# EAGLE schematic light_controller (EAGLE 8.5.0)
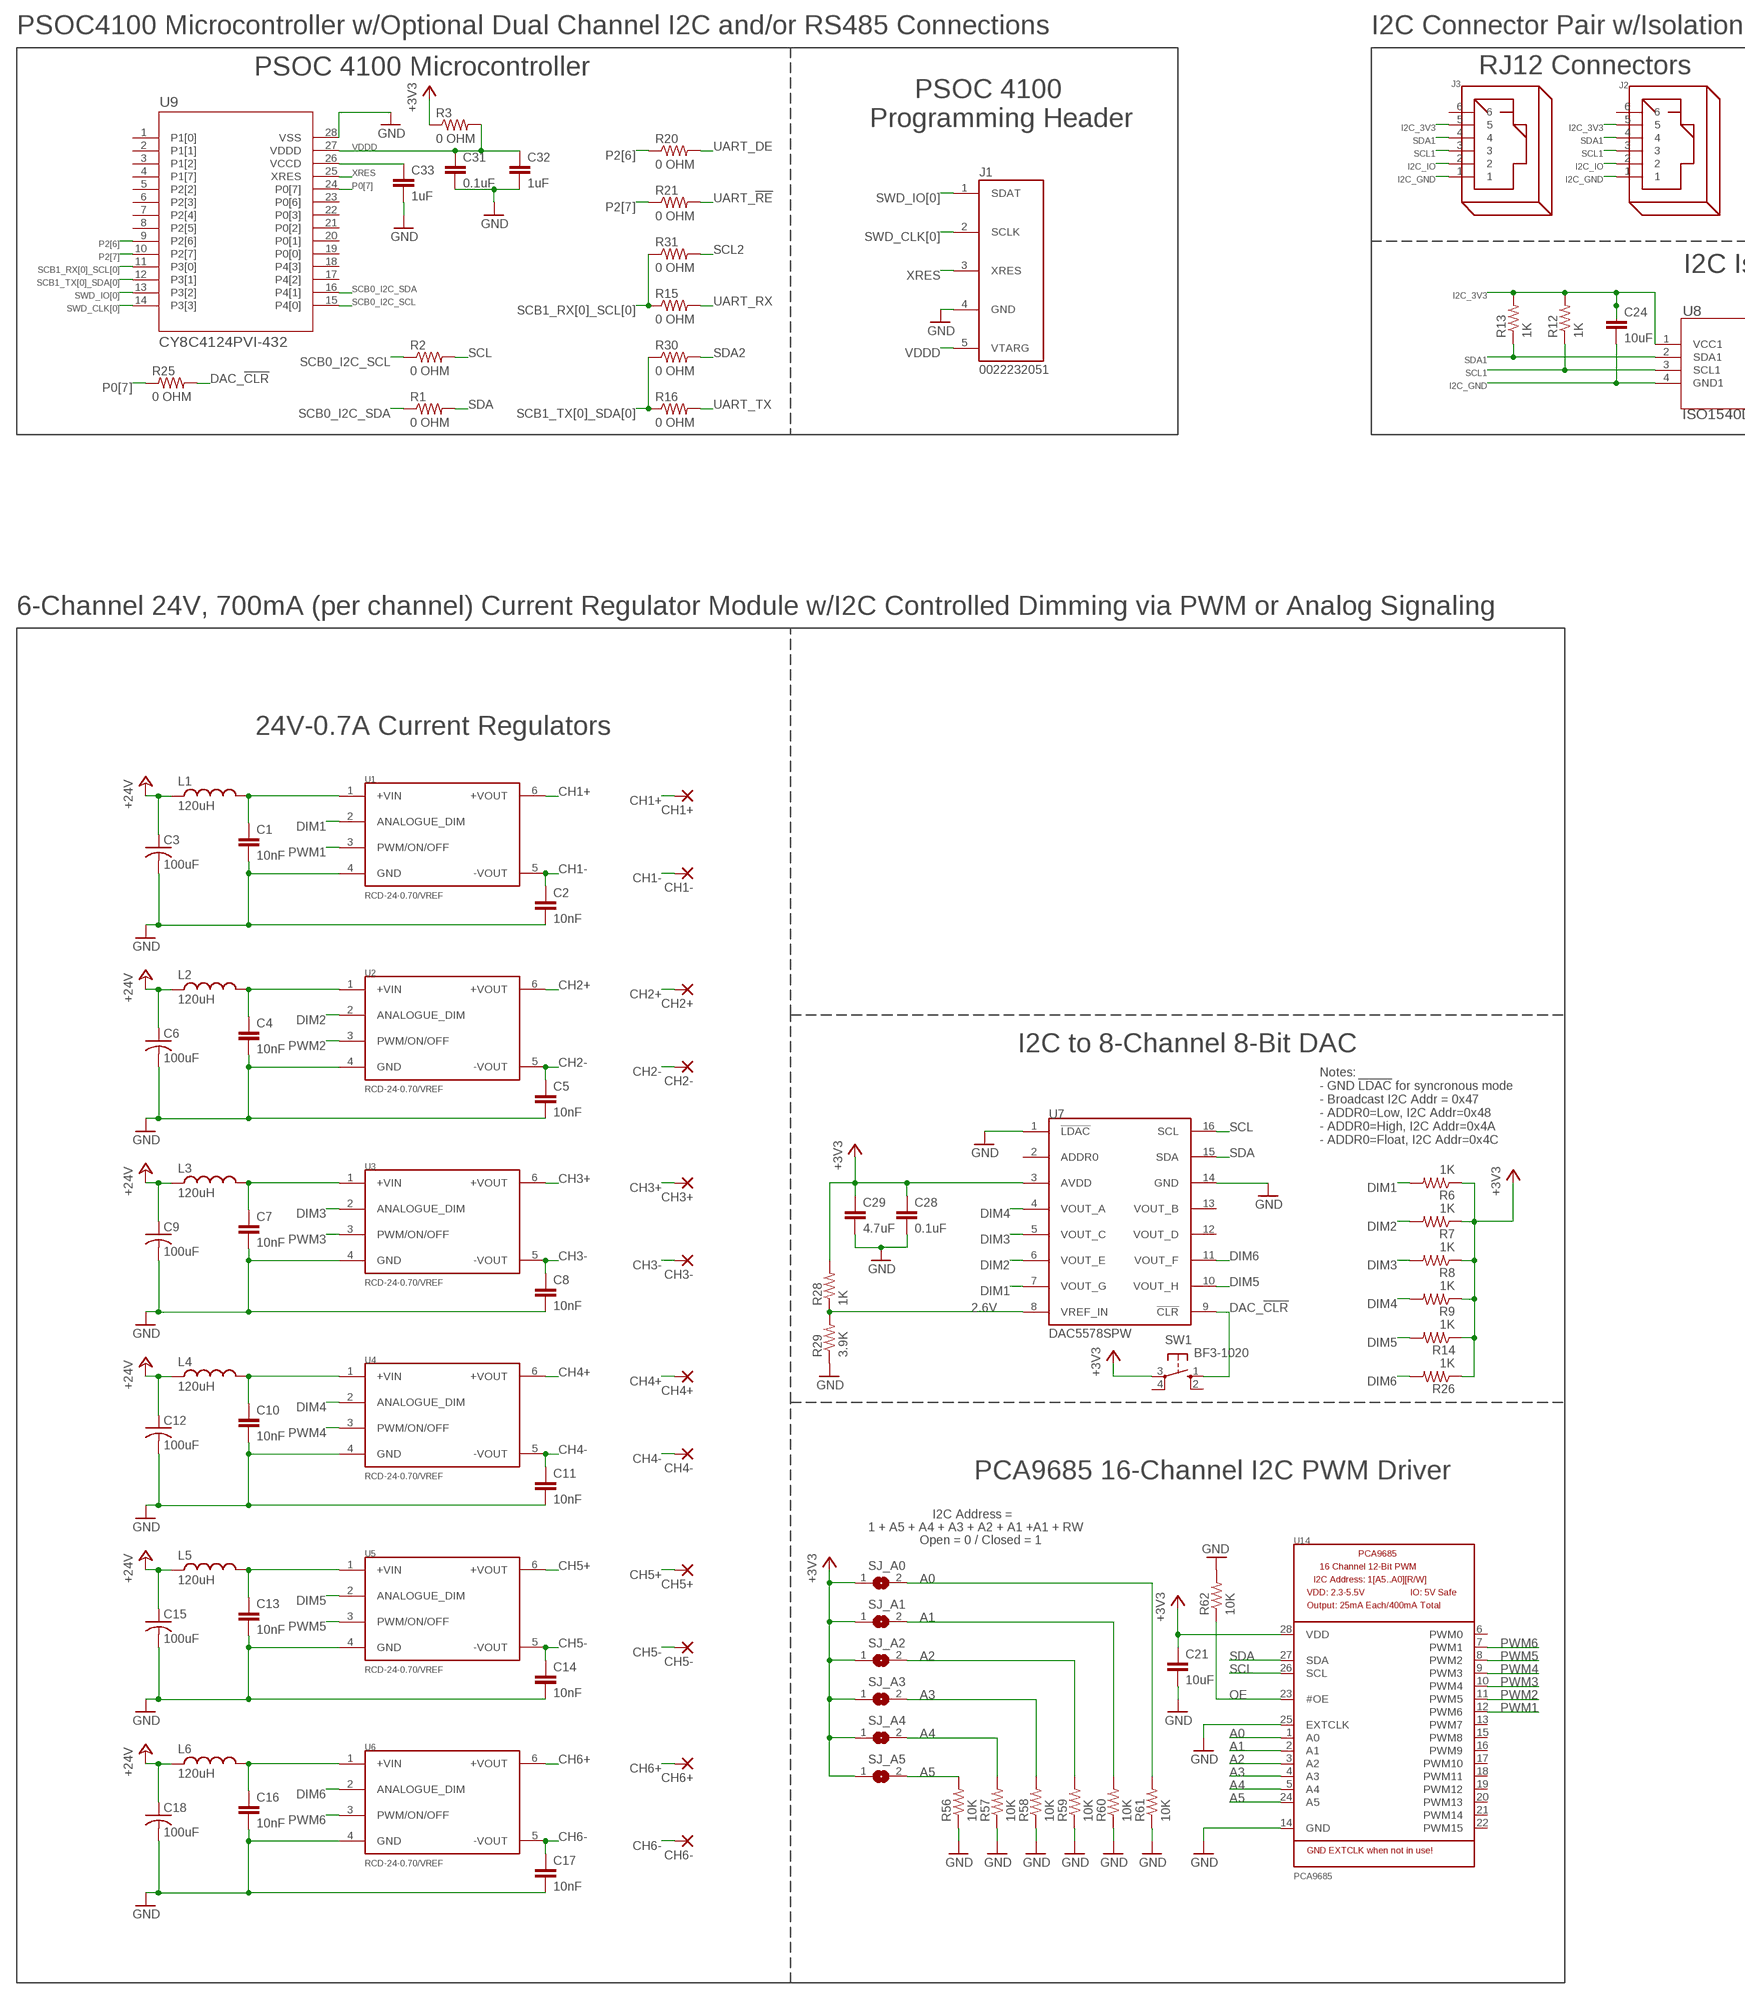
[diagram p0: schematic, sheet 1, part 1 of 2]
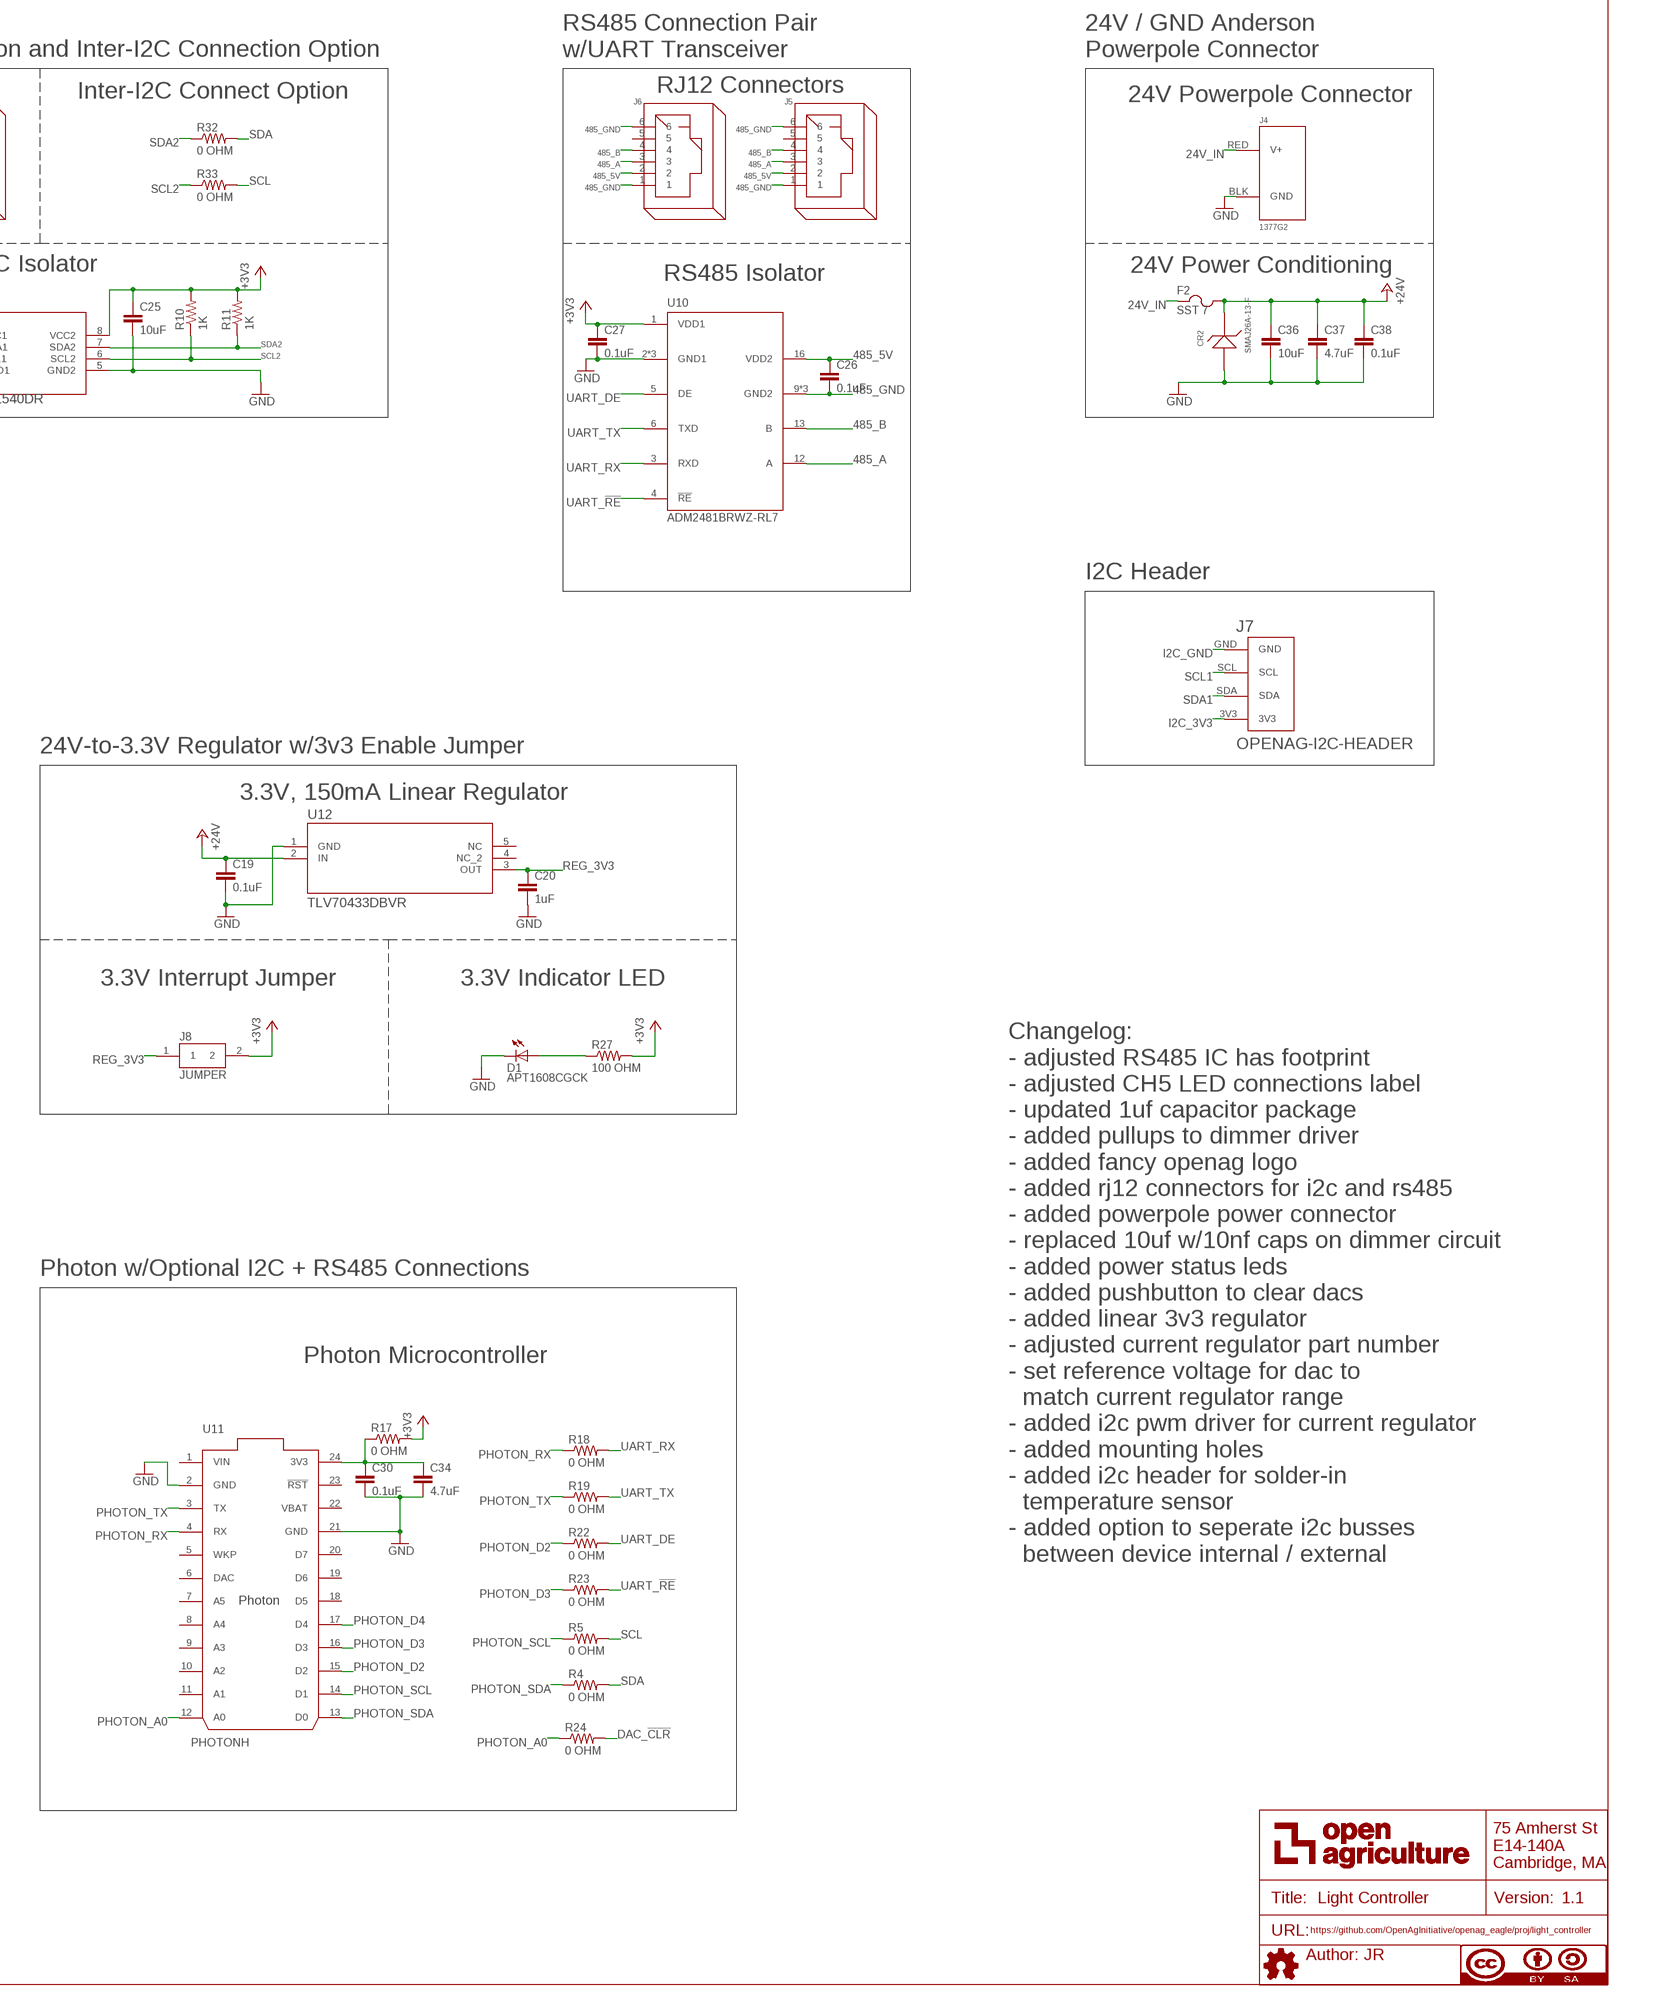
[diagram p1: schematic, sheet 1, part 2 of 2]

## Parts
C1  10nF  10NF-C0603C103K5RACTU  [C0603]
C2  10nF  10NF-C0603C103K5RACTU  [C0603]
C3  100uF  100UF-EEE-1HA101UP  [EEE-1HA101UP]
C4  10nF  10NF-C0603C103K5RACTU  [C0603]
C5  10nF  10NF-C0603C103K5RACTU  [C0603]
C6  100uF  100UF-EEE-1HA101UP  [EEE-1HA101UP]
C7  10nF  10NF-C0603C103K5RACTU  [C0603]
C8  10nF  10NF-C0603C103K5RACTU  [C0603]
C9  100uF  100UF-EEE-1HA101UP  [EEE-1HA101UP]
C10  10nF  10NF-C0603C103K5RACTU  [C0603]
C11  10nF  10NF-C0603C103K5RACTU  [C0603]
C12  100uF  100UF-EEE-1HA101UP  [EEE-1HA101UP]
C13  10nF  10NF-C0603C103K5RACTU  [C0603]
C14  10nF  10NF-C0603C103K5RACTU  [C0603]
C15  100uF  100UF-EEE-1HA101UP  [EEE-1HA101UP]
C16  10nF  10NF-C0603C103K5RACTU  [C0603]
C17  10nF  10NF-C0603C103K5RACTU  [C0603]
C18  100uF  100UF-EEE-1HA101UP  [EEE-1HA101UP]
C19  0.1uF  0.1UF-C0603C104K5RACTU  [C0603]
C20  1uF  1UF-CL10A105KB8NNNC  [C0603]
C21  10uF  10UF-GMK212BBJ106KG-T  [C0805]
C24  10uF  10UF-GMK212BBJ106KG-T  [C0805]
C25  10uF  10UF-GMK212BBJ106KG-T  [C0805]
C26  0.1uF  0.1UF-C0603C104K5RACTU  [C0603]
C27  0.1uF  0.1UF-C0603C104K5RACTU  [C0603]
C28  0.1uF  0.1UF-C0603C104K5RACTU  [C0603]
C29  4.7uF  4.7UF-CL21A475KBQNNNE  [C0805]
C30  0.1uF  0.1UF-C0603C104K5RACTU  [C0603]
C31  0.1uF  0.1UF-C0603C104K5RACTU  [C0603]
C32  1uF  1UF-CL10A105KB8NNNC  [C0603]
C33  1uF  1UF-CL10A105KB8NNNC  [C0603]
C34  4.7uF  4.7UF-CL21A475KBQNNNE  [C0805]
C36  10uF  10UF-GMK212BBJ106KG-T  [C0805]
C37  4.7uF  4.7UF-CL21A475KBQNNNE  [C0805]
C38  0.1uF  0.1UF-C0603C104K5RACTU  [C0603]
CH1+  3,17/1,3  [3,17/1,3]
CH1-  3,17/1,3  [3,17/1,3]
CH2+  3,17/1,3  [3,17/1,3]
CH2-  3,17/1,3  [3,17/1,3]
CH3+  3,17/1,3  [3,17/1,3]
CH3-  3,17/1,3  [3,17/1,3]
CH4+  3,17/1,3  [3,17/1,3]
CH4-  3,17/1,3  [3,17/1,3]
CH5+  3,17/1,3  [3,17/1,3]
CH5-  3,17/1,3  [3,17/1,3]
CH6+  3,17/1,3  [3,17/1,3]
CH6-  3,17/1,3  [3,17/1,3]
CR2  SMAJ26A-13-F  [SMA]
D1  APT1608CGCK  [CHIPLED_0603]
F2  SST 7  SST_7  [SS]
FRAME1  DOCFIELD  [DOCFIELD]
J1  0022232051  MINI-PROG3-5POS-MATING-CONNECTOR  [22-23-2051]
J2  OPENAG-I2C-RJ12  [OPENAG-I2C-RJ12]
J3  OPENAG-I2C-RJ12  [OPENAG-I2C-RJ12]
J4  1377G2  1377G21377G2  [1377G2]
J5  OPENAG-RS485-RJ12  [OPENAG-RS485-RJ12]
J6  OPENAG-RS485-RJ12  [OPENAG-RS485-RJ12]
J7  OPENAG-I2C-HEADER  [OPENAG-I2C-HEADER]
J8  JUMPER  100-MIL-HEADER-JUMPER  [1X2-100-MIL-HEADER]
L1  120uH  120UH-74404064121  [74404064121]
L2  120uH  120UH-74404064121  [74404064121]
L3  120uH  120UH-74404064121  [74404064121]
L4  120uH  120UH-74404064121  [74404064121]
L5  120uH  120UH-74404064121  [74404064121]
L6  120uH  120UH-74404064121  [74404064121]
R1  0 OHM  0OHM-RC0603JR-070RL  [RC0603N]
R2  0 OHM  0OHM-RC0603JR-070RL  [RC0603N]
R3  0 OHM  0OHM-RC0603JR-070RL  [RC0603N]
R4  0 OHM  0OHM-RC0603JR-070RL  [RC0603N]
R5  0 OHM  0OHM-RC0603JR-070RL  [RC0603N]
R6  1K  1K-ERJ-PB3D1001V  [RC0603N]
R7  1K  1K-ERJ-PB3D1001V  [RC0603N]
R8  1K  1K-ERJ-PB3D1001V  [RC0603N]
R9  1K  1K-ERJ-PB3D1001V  [RC0603N]
R10  1K  1K-ERJ-PB3D1001V  [RC0603N]
R11  1K  1K-ERJ-PB3D1001V  [RC0603N]
R12  1K  1K-ERJ-PB3D1001V  [RC0603N]
R13  1K  1K-ERJ-PB3D1001V  [RC0603N]
R14  1K  1K-ERJ-PB3D1001V  [RC0603N]
R15  0 OHM  0OHM-RC0603JR-070RL  [RC0603N]
R16  0 OHM  0OHM-RC0603JR-070RL  [RC0603N]
R17  0 OHM  0OHM-RC0603JR-070RL  [RC0603N]
R18  0 OHM  0OHM-RC0603JR-070RL  [RC0603N]
R19  0 OHM  0OHM-RC0603JR-070RL  [RC0603N]
R20  0 OHM  0OHM-RC0603JR-070RL  [RC0603N]
R21  0 OHM  0OHM-RC0603JR-070RL  [RC0603N]
R22  0 OHM  0OHM-RC0603JR-070RL  [RC0603N]
R23  0 OHM  0OHM-RC0603JR-070RL  [RC0603N]
R24  0 OHM  0OHM-RC0603JR-070RL  [RC0603N]
R25  0 OHM  0OHM-RC0603JR-070RL  [RC0603N]
R26  1K  1K-ERJ-PB3D1001V  [RC0603N]
R27  100 OHM  100OHM-RC0603JR-07100RL  [RC0603N]
R28  1K  1K-ERJ-PB3D1001V  [RC0603N]
R29  3.9K  3.9K-RC0603JR-073K9L  [RC0603N]
R30  0 OHM  0OHM-RC0603JR-070RL  [RC0603N]
R31  0 OHM  0OHM-RC0603JR-070RL  [RC0603N]
R32  0 OHM  0OHM-RC0603JR-070RL  [RC0603N]
R33  0 OHM  0OHM-RC0603JR-070RL  [RC0603N]
R56  10K  10K-ERJ-3EKF1002V  [RC0603N]
R57  10K  10K-ERJ-3EKF1002V  [RC0603N]
R58  10K  10K-ERJ-3EKF1002V  [RC0603N]
R59  10K  10K-ERJ-3EKF1002V  [RC0603N]
R60  10K  10K-ERJ-3EKF1002V  [RC0603N]
R61  10K  10K-ERJ-3EKF1002V  [RC0603N]
R62  10K  10K-ERJ-3EKF1002V  [RC0603N]
SJ_A0  SOLDERJUMPERREFLOW_NOPASTE  [SOLDERJUMPER_REFLOW_NOPASTE]
SJ_A1  SOLDERJUMPERREFLOW_NOPASTE  [SOLDERJUMPER_REFLOW_NOPASTE]
SJ_A2  SOLDERJUMPERREFLOW_NOPASTE  [SOLDERJUMPER_REFLOW_NOPASTE]
SJ_A3  SOLDERJUMPERREFLOW_NOPASTE  [SOLDERJUMPER_REFLOW_NOPASTE]
SJ_A4  SOLDERJUMPERREFLOW_NOPASTE  [SOLDERJUMPER_REFLOW_NOPASTE]
SJ_A5  SOLDERJUMPERREFLOW_NOPASTE  [SOLDERJUMPER_REFLOW_NOPASTE]
SW1  BF3-1020  [B3F-10XX]
U1  RCD-24-0.70/VREF  [RCD-24-PINNED]
U2  RCD-24-0.70/VREF  [RCD-24-PINNED]
U3  RCD-24-0.70/VREF  [RCD-24-PINNED]
U4  RCD-24-0.70/VREF  [RCD-24-PINNED]
U5  RCD-24-0.70/VREF  [RCD-24-PINNED]
U6  RCD-24-0.70/VREF  [RCD-24-PINNED]
U7  DAC5578SPW  [TSSOP16]
U8  ISO1540DR  [D8]
U9  CY8C4124PVI-432  [SSOP-28]
U10  ADM2481BRWZ-RL7  [SOIC16LWB]
U11  PHOTONH  PHOTONHPHOTONH  [PHOTON]
U12  TLV70433DBVR  TLV70433DBVRDBV5-M  [DBV5-M]
U14  PCA9685  PCA9685PW/Q900,118  [TSSOP28]

## Nets
2.6V: R28.1 R29.2 U7.8(VREF_IN)
24V_IN: F2.1 J4.RED(V+)
485_5V: C26.1 J5.2 J6.2 U10.16(VDD2)
485_A: J5.3 J6.3 U10.12(A)
485_B: J5.4 J6.4 U10.13(B)
485_GND: C26.2 J5.1 J5.6 J6.1 J6.6 U10.9(GND2) U10.10(GND2) U10.15(GND2)
+3V3: C21.1 C25.1 C27.1 C28.1 C29.1 J8.2 R3.1 R6.1 R7.1 R8.1 R9.1 R10.2 R11.2 R14.1 R17.2 R26.1 R27.2 R28.2 SJ_A0.1 SJ_A1.1 SJ_A2.1 SJ_A3.1 SJ_A4.1 SJ_A5.1 SW1.3(P) U7.3(AVDD) U8.8(VCC2) U10.1(VDD1) U14.28(VDD)
+24V: C3.+(1(+)) C6.+(1(+)) C9.+(1(+)) C12.+(1(+)) C15.+(1(+)) C18.+(1(+)) C19.1 C36.1 C37.1 C38.1 CR2.1 F2.2 L1.1 L2.1 L3.1 L4.1 L5.1 L6.1 U12.2(IN)
A0: R61.2 SJ_A0.2 U14.1(A0)
A1: R60.2 SJ_A1.2 U14.2(A1)
A2: R59.2 SJ_A2.2 U14.3(A2)
A3: R58.2 SJ_A3.2 U14.4(A3)
A4: R57.2 SJ_A4.2 U14.5(A4)
A5: R56.2 SJ_A5.2 U14.24(A5)
CH1+: CH1+.1(P) U1.6(+VOUT)
CH1-: C2.1 CH1-.1(P) U1.5(-VOUT)
CH2+: CH2+.1(P) U2.6(+VOUT)
CH2-: C5.1 CH2-.1(P) U2.5(-VOUT)
CH3+: CH3+.1(P) U3.6(+VOUT)
CH3-: C8.1 CH3-.1(P) U3.5(-VOUT)
CH4+: CH4+.1(P) U4.6(+VOUT)
CH4-: C11.1 CH4-.1(P) U4.5(-VOUT)
CH5+: CH5+.1(P) U5.6(+VOUT)
CH5-: C14.1 CH5-.1(P) U5.5(-VOUT)
CH6+: CH6+.1(P) U6.6(+VOUT)
CH6-: C17.1 CH6-.1(P) U6.5(-VOUT)
DAC_!CLR!: R24.2 R25.2 SW1.1(S) U7.9(!CLR!)
DIM1: R6.2 U1.2(ANALOGUE_DIM) U7.7(VOUT_G)
DIM2: R7.2 U2.2(ANALOGUE_DIM) U7.6(VOUT_E)
DIM3: R8.2 U3.2(ANALOGUE_DIM) U7.5(VOUT_C)
DIM4: R9.2 U4.2(ANALOGUE_DIM) U7.4(VOUT_A)
DIM5: R14.2 U5.2(ANALOGUE_DIM) U7.10(VOUT_H)
DIM6: R26.2 U6.2(ANALOGUE_DIM) U7.11(VOUT_F)
GND: C1.2 C2.2 C3.-(2(-)) C4.2 C5.2 C6.-(2(-)) C7.2 C8.2 C9.-(2(-)) C10.2 C11.2 C12.-(2(-)) C13.2 C14.2 C15.-(2(-)) C16.2 C17.2 C18.-(2(-)) C19.2 C20.2 C21.2 C25.2 C27.2 C28.2 C29.2 C30.2 C31.2 C32.2 C33.2 C34.2 C36.2 C37.2 C38.2 CR2.2 D1.C J1.4(GND) J4.BLK(GND) R29.1 R56.1 R57.1 R58.1 R59.1 R60.1 R61.1 R62.2 U1.4(GND) U2.4(GND) U3.4(GND) U4.4(GND) U5.4(GND) U6.4(GND) U7.1(!LDAC!) U7.14(GND) U8.5(GND2) U9.28(VSS) U10.2(GND1) U10.7(GND1) U10.8(GND1) U11.2(GND) U11.21(GND) U12.1(GND) U14.14(GND) U14.25(EXTCLK)
I2C_3V3: C24.1 J2.5 J3.5 J7.3V3 R12.2 R13.2 U8.1(VCC1)
I2C_GND: C24.2 J2.1 J3.1 J7.GND U8.4(GND1)
I2C_IO: J2.2 J3.2
N$1: C1.1 L1.2 U1.1(+VIN)
N$2: C4.1 L2.2 U2.1(+VIN)
N$3: D1.A R27.1
N$4: C7.1 L3.2 U3.1(+VIN)
N$5: C10.1 L4.2 U4.1(+VIN)
N$6: C13.1 L5.2 U5.1(+VIN)
N$7: C16.1 L6.2 U6.1(+VIN)
N$8: C30.1 C34.1 R17.1 U11.24(3V3)
N$23: C33.1 U9.26(VCCD)
OE: R62.1 U14.23(#OE)
P0[7]: R25.1 U9.24(P0[7])
P2[6]: R20.1 U9.9(P2[6])
P2[7]: R21.1 U9.10(P2[7])
PHOTON_A0: R24.1 U11.12(A0)
PHOTON_D2: R22.1 U11.15(D2)
PHOTON_D3: R23.1 U11.16(D3)
PHOTON_D4: U11.17(D4)
PHOTON_RX: R18.1 U11.4(RX)
PHOTON_SCL: R5.1 U11.14(D1)
PHOTON_SDA: R4.1 U11.13(D0)
PHOTON_TX: R19.1 U11.3(TX)
PWM1: U1.3(PWM/ON/OFF) U14.12(PWM6)
PWM2: U2.3(PWM/ON/OFF) U14.11(PWM5)
PWM3: U3.3(PWM/ON/OFF) U14.10(PWM4)
PWM4: U4.3(PWM/ON/OFF) U14.9(PWM3)
PWM5: U5.3(PWM/ON/OFF) U14.8(PWM2)
PWM6: U6.3(PWM/ON/OFF) U14.7(PWM1)
REG_3V3: C20.1 J8.1 U12.3(OUT)
SCB0_I2C_SCL: R2.1 U9.15(P4[0])
SCB0_I2C_SDA: R1.1 U9.16(P4[1])
SCB1_RX[0]_SCL[0]: R15.1 R31.1 U9.11(P3[0])
SCB1_TX[0]_SDA[0]: R16.1 R30.1 U9.12(P3[1])
SCL: R2.2 R5.2 R33.2 U7.16(SCL) U14.26(SCL)
SCL1: J2.3 J3.3 J7.SCL R12.1 U8.3(SCL1)
SCL2: R10.1 R31.2 R33.1 U8.6(SCL2)
SDA: R1.2 R4.2 R32.2 U7.15(SDA) U14.27(SDA)
SDA1: J2.4 J3.4 J7.SDA R13.1 U8.2(SDA1)
SDA2: R11.1 R30.2 R32.1 U8.7(SDA2)
SWD_CLK[0]: J1.2(SCLK) U9.14(P3[3])
SWD_IO[0]: J1.1(SDAT) U9.13(P3[2])
UART_!RE!: R21.2 R23.2 U10.4(!RE!)
UART_DE: R20.2 R22.2 U10.5(DE)
UART_RX: R15.2 R18.2 U10.3(RXD)
UART_TX: R16.2 R19.2 U10.6(TXD)
VDDD: C31.1 C32.1 J1.5(VTARG) R3.2 U9.27(VDDD)
XRES: J1.3(XRES) U9.25(XRES)
Unconnected: J2.6 J3.6 J5.5 J6.5 SW1.2(S1) SW1.4(P1) U7.2(ADDR0) U7.12(VOUT_D) U7.13(VOUT_B) U9.1(P1[0]) U9.2(P1[1]) U9.3(P1[2]) U9.4(P1[7]) U9.5(P2[2]) U9.6(P2[3]) U9.7(P2[4]) U9.8(P2[5]) U9.17(P4[2]) U9.18(P4[3]) U9.19(P0[0]) U9.20(P0[1]) U9.21(P0[2]) U9.22(P0[3]) U9.23(P0[6]) U11.5(WKP) U11.6(DAC) U11.7(A5) U11.8(A4) U11.9(A3) U11.10(A2) U11.11(A1) U11.18(D5) U11.19(D6) U11.20(D7) U11.23(!RST) U12.4(NC_2) U12.5(NC) U14.6(PWM0) U14.13(PWM7) U14.15(PWM8) U14.16(PWM9) U14.17(PWM10) U14.18(PWM11) U14.19(PWM12) U14.20(PWM13) U14.21(PWM14) U14.22(PWM15)

## Notes on the sheet
- PSOC4100 Microcontroller w/Optional Dual Channel I2C and/or RS485 Connections | I2C Connector Pair w/Isolation and Inter-I2C Connection Option
- RS485 Connection Pair 
  w/UART Transceiver
- 24V / GND Anderson
  Powerpole Connector
- PSOC 4100 Microcontroller | RJ12 Connectors | Inter-I2C Connect Option | RJ12 Connectors
- 24V Powerpole Connector
- PSOC 4100 
  Programming Header
- I2C Isolator | 24V Power Conditioning
- RS485 Isolator
- 6-Channel 24V, 700mA (per channel) Current Regulator Module w/I2C Controlled Dimming via PWM or Analog Signaling | I2C Header
- 24V-0.7A Current Regulators
- 24V-to-3.3V Regulator w/3v3 Enable Jumper
- 3.3V, 150mA Linear Regulator
- I2C to 8-Channel 8-Bit DAC
- 3.3V Interrupt Jumper | 3.3V Indicator LED
- Notes:
  - GND !LDAC! for syncronous mode
  - Broadcast I2C Addr = 0x47
  - ADDR0=Low, I2C Addr=0x48
  - ADDR0=High, I2C Addr=0x4A
  - ADDR0=Float, I2C Addr=0x4C
- Photon w/Optional I2C + RS485 Connections
- PCA9685 16-Channel I2C PWM Driver | Photon Microcontroller
- I2C Address =
- 1 + A5 + A4 + A3 + A2 + A1 +A1 + RW
- Open = 0 / Closed = 1
- Changelog:
  - adjusted RS485 IC has footprint 
  - adjusted CH5 LED connections label
  - updated 1uf capacitor package
  - added pullups to dimmer driver
  - added fancy openag logo
  - added rj12 connectors for i2c and rs485
  - added powerpole power connector
  - replaced 10uf w/10nf caps on dimmer circuit
  - added power status leds
  - added pushbutton to clear dacs
  - added linear 3v3 regulator
  - adjusted current regulator part number
  - set reference voltage for dac to 
    match current regulator range
  - added i2c pwm driver for current regulator
  - added mounting holes
  - added i2c header for solder-in 
    temperature sensor
  - added option to seperate i2c busses 
    between device internal / external

## Power pins joined to a net without a drawn wire
VBAT: U11.22(VBAT)
VIN: U11.1(VIN)

## Library data of the parts
C1 C2 C4 C5 C7 C8 C10 C11 C13 C14 C16 C17 = openag-capacitors:10NF-C0603C103K5RACTU: KEMET - C0603C103K5RACTU - CAP CER 10000PF 50V X7R 0603 Description: 10000pF ±10% 50V Ceramic Capacitor X7R 0603 (1608 Metric) Technical Specifications: Capacitance: 10000pF Tolerance: ±10% Voltage - Rated: 50V Temperature Coefficient: X7R Operating Temperature: -55°C ~ 125°C Applications: General Purpose Mounting Type: Surface Mount, MLCC Package / Case: 0603 (1608 Metric) Size / Dimension: 0.063" L x 0.032" W (1.60mm x 0.80mm) Thickness (Max): 0.034" (0.87mm) Datasheet(s): X7R Dielectric, 6.3-250 VDC <https://search.kemet.com/component-edge/download/datasheet/C0603C103K5RACTU.pdf> Vendor(s): Digikey: 399-1091-1-ND <https://www.digikey.com/product-detail/en/kemet/C0603C103K5RACTU/399-1091-1-ND/411366#>; POPULATE: YES; VERIFIED: NO
C3 C6 C9 C12 C15 C18 = openag-capacitors:100UF-EEE-1HA101UP: Panasonic - EEE-1HA101UP - ELECTROLYTIC CAP ALUM 100UF 20% 50V SMD Description: 100µF 50V Aluminum Electrolytic Capacitors Radial, Can - SMD 2000 Hrs @ 85°C Technical Specifications: Capacitance: 100uF Tolerance: ±20% Rated Voltage: 50V Polarization: Polar Operating Temperature: -40°C ~ 85°C Datasheet(s): S Series, Type V <https://industrial.panasonic.com/cdbs/www-data/pdf/RDE0000/ABA0000C1145.pdf> Vendor(s): Digikey: PCE3917CT-ND <https://www.digikey.com/product-detail/en/panasonic-electronic-components/EEE-1HA101UP/PCE3917CT-ND/766293>; POPULATE: YES; VERIFIED: NO
C19 C26-C28 C30 C31 C38 = openag-capacitors:0.1UF-C0603C104K5RACTU: Kemet - C0603C104K5RACTU - CAP CER 0.1UF 50V X7R 0603 Description: 0.1µF ±10% 50V Ceramic Capacitor X7R 0603 (1608 Metric) Technical Specifications: Capacitance: 0.1µF Tolerance: ±10% Rated Voltage: 50V Temperature Coefficient: X7R Operating Temperature: -55°C ~ 125°C Package / Case: 0603 (1608 Metric) Datasheet(s): X7R Dielectric, 6.3-250 VDC <https://search.kemet.com/component-edge/download/datasheet/C0603C104K5RACTU.pdf> Vendor(s): Digikey: 399-5089-1-ND <https://www.digikey.com/product-detail/en/kemet/C0603C104K5RACTU/399-5089-1-ND/1465623>; POPULATE: YES; VERIFIED: NO
C20 C32 C33 = openag-capacitors:1UF-CL10A105KB8NNNC: Samsung - CL10A105KB8NNNC - CAP CER 1UF 50V X5R 0603 Description: 1µF ±10% 50V Ceramic Capacitor X5R 0603 (1608 Metric) Technical Specifications: Capacitance: 1µF Tolerance: ±10% Rated Voltage: 50V Temperature Coefficient: X5R Operating Temperature: -55°C ~ 85°C Packaging / Case: 0603 (1608 Metric) Datasheet(s): CL10A105KB8NNNC Spec <http://www.samsungsem.com/kr/support/product-search/mlcc/CL10A105KB8NNNC.jsp> Vendor(s): Digikey: 1276-1860-1-ND <https://www.digikey.com/product-detail/en/samsung-electro-mechanics-america-inc/CL10A105KB8NNNC/1276-1860-1-ND/3889946>; POPULATE: YES; VERIFIED: NO
C21 C24 C25 C36 = openag-capacitors:10UF-GMK212BBJ106KG-T: Taiyo Yuden - GMK212BBJ106KG-T - CAP CER 10UF 35V X5R 0805 Description: 10µF ±10% 35V Ceramic Capacitor X5R 0805 (2012 Metric) Technical Specifications: Capacitance: 10µF Tolerance: ±10% Rated Voltage: 35V Temperature Coefficient: X5R Operating Temperature: -55°C ~ 85°C Package / Case: 0805 (2012 Metric) Datasheet(s): GMK212BBJ106KG-T Spec <http://ds.yuden.co.jp/TYCOMPAS/ut/detail.do?productNo=GMK212BBJ106KG-T&fileName=GMK212BBJ106KG-T_SS&mode=specSheetDownload> Vendor(s): Digikey: 587-4893-1-ND <https://www.digikey.com/product-detail/en/taiyo-yuden/GMK212BBJ106KG-T/587-4893-1-ND/6563736>; POPULATE: YES; VERIFIED: NO
C29 C34 C37 = openag-capacitors:4.7UF-CL21A475KBQNNNE: Samsung - CL21A475KBQNNNE - CAP CER 4.7UF 50V X5R 0805 Description: 4.7µF ±10% 50V Ceramic Capacitor X5R 0805 (2012 Metric) Technical Specifications: Capacitance: 4.7uF Tolerance: ±10% Rated Voltage: 50V Temperature Coefficient: X5R Operating Temperature: -55°C ~ 85°C Package/Case: 0805 (2012 Metric) Datasheet(s): CL21A475KBQNNNE Characteristics <http://www.samsungsem.com/kr/front/downloadcms.do?path=/kr/support/product-search/mlcc/__icsFiles/afieldfile/2014/11/05&fileName=C_CL21A475KBQNNNE.pdf> Vendor(s): Digikey: 1276-1248-1-ND <https://www.digikey.com/product-detail/en/samsung-electro-mechanics/CL21A475KBQNNNE/1276-1248-1-ND/3889334>; POPULATE: YES; VERIFIED: NO
CH1+ CH1- CH2+ CH2- CH3+ CH3- CH4+ CH4- CH5+ CH5- CH6+ CH6- = openag-wirepads:3,17/1,3: THROUGH-HOLE PAD
CR2 = openag-diodes:SMAJ26A-13-F: Diodes Incorporated - SMAJ26A-13-F - TVS DIODE 26VWM 42.1VC SMA Description: TVS DIODE 26VWM 42.1VC SMA Technical Specifications: Type: Zener Voltage - Reverse Standoff (Typ): 26V Voltage - Breakdown (Min): 28.9V Voltage - Clamping (Max) @ Ipp: 42.1V Current - Peak Pulse (10/1000µs): 9.5A Power - Peak Pulse: 400W Power Line Protection: No Operating Temperature: -55°C ~ 150°C (TJ) DO-214AC, SMA Datasheet(s): SMAJ5.0(C)A - SMAJ200(C)A Vendor(s): Digikey: SMAJ26A-FDICT-ND <https://www.digikey.com/product-detail/en/diodes-incorporated/SMAJ26A-13-F/SMAJ26A-FDICT-ND/806583>; POPULATE: YES; VERIFIED: NO
D1 = openag-diodes:APT1608CGCK: Kingbright - APT1608CGCK - LED GREEN CLEAR 0603 SMD Description: Green 570nm LED Indication - Discrete 2.1V 0603 (1608 Metric) Technical Specifications: Color: Green Lens Color: Colorless Lens Transparency: Clear Millicandela Rating: 50mcd Lens Style/Size: Rectangle with Flat Top, 1.20mm x 0.80mm Voltage - Forward (Vf) (Typ): 2.1V Current - Test: 20mA Viewing Angle: 120° Mounting Type: Surface Mount Wavelength - Dominant: 570nm Wavelength - Peak: 574nm Package / Case: 0603 (1608 Metric) Supplier Device Package: Chip LED Size / Dimension: 1.60mm L x 0.80mm W Height (Max): 0.75mm Datasheet(s): APT1608CGCK <http://www.kingbrightusa.com/images/catalog/SPEC/APT1608CGCK.pdf> Vendor(s): Digikey: 754-1116-1-ND <https://www.digikey.com/product-detail/en/kingbright/APT1608CGCK/754-1116-1-ND/1747833#>; POPULATE: YES; VERIFIED: NO
F2 = openag-fuses:SST_7: Bel Fuse - SST7 - FUSE BRD MNT 7A 125VAC/VDC 2SMD Description: FUSE BRD MNT 7A 125VAC/VDC 2SMD Technical Specifications: Current Rating: 7A Voltage Rating: 125V Fuse Type: Board Mount (Cartridge Style Excluded) Mounting Type: Surface Mount Operating Temperature: -55°C ~ 125°C Datasheet(s): SST Type <https://belfuse.com/resources/StewartConnector/SST.pdf> Vendor(s): Digikey: 507-1072-1-ND <https://www.digikey.com/product-detail/en/bel-fuse-inc/SST-7/507-1072-1-ND/615026>; POPULATE: YES; VERIFIED: NO
FRAME1 = openag-frames:DOCFIELD: DOCUMENT FIELD; AUTHOR: JR; DESCRIPTION: Controls 6 channels of 24V, 700mA for LED strings that can be interfaced via i2c, rs485, and/or wifi.; TITLE: Light Controller; URL: https://github.com/OpenAgInitiative/openag_eagle/proj/light_controller; VER: 1.1
J1 = openag-connectors:MINI-PROG3-5POS-MATING-CONNECTOR: Molex - 0022232051 - CONN HEADER 5POS .100 VERT TIN Description: 5 Positions Header Connector 0.100" (2.54mm) Through Hole Tin This is the specified mating connector for programming a PSOC microcontroller with the MiniProg3 Programmer Technical Specifications: Connector Type: Header Contact Type: Male Pin Pitch - Mating: 0.100" (2.54mm) Number of Positions: 5 Number of Rows: 1 Mounting Type: Through Hole Fastening Type: Friction Lock Datasheet(s): Molex 22-23-2051 <http://www.molex.com/pdm_docs/sd/022232051_sd.pdf> Cypress CY8CKIT-002 Brief <http://www.cypress.com/file/44091/download> Vendor(s): Digikey: WM4203-ND (Molex Connector) <https://www.digikey.com/products/en?keywords=22-23-2051> Digikey: 428-2975-ND (Cypress Programmer Kit) <https://www.digikey.com/product-detail/en/cypress-semiconductor-corp/CY8CKIT-002/428-2975-ND/2126344>; POPULATE: YES; VERIFIED: NO
J2 J3 = openag-connectors:OPENAG-I2C-RJ12: Assmann WSW Components - A-2004-1-4-LP-N-R - RJ12 CONN MOD JACK 6P6C R/A UNSHLD Description: Jack Modular Connector 6p6c (RJ11, RJ12, RJ14, RJ25) 90° Angle (Right) Unshielded Technical Specifications: Connector Type: Jack Number of Positions/Contacts: 6p6c (RJ11, RJ12, RJ14, RJ25) Number of Ports: 1 Number of Rows: 1 Mounting Type: Through Hole Orientation: 90° Angle (Right) Termination: Solder Shielding: Unshielded Features: Board Lock LED Color: Does Not Contain LED Tab Direction: Down Contact Material: Phosphor Bronze Contact Finish: Gold Contact Finish Thickness: 6µin (0.152µm) Housing Material: Polybutylene Terephthalate (PBT), Glass Filled Operating Temperature: -40°C ~ 85°C Datasheet(s): A-2004-1-4-LP-N Drawing <http://www.assmann-wsw.com/fileadmin/datasheets/ASS_7320_CO.pdf> Vendor(s): Digikey: AE10383-ND <https://www.digikey.com/product-detail/en/assmann-wsw-components/A-2004-1-4-LP-N-R/AE10383-ND/2183634>; MPN: A-2004-1-4-LP-N-R
J4 = openag-connectors:1377G2: Anderson Powerpole - 1377G2 - RT. ANGLE 25A THRU-HOLE PCB CONTACT PAIR FOR 15/45 HOUSING Description: Heavy Duty Power Connectors PP PCB .40/1.295 RT.ANG.CONT. short one Technical Specifications: Current Rating: 25A Voltage Rating: 600 V Datasheet(s): 1377G2 Datasheet <http://www.mouser.com/ds/2/22/ds-pp1545-766098.pdf> Vendor(s): Mouser: 879-1377G2 <https://www.mouser.com/ProductDetail/Anderson-Power-Products/1377G2/?qs=sGAEpiMZZMtjzVbpKqo2YZRH3O%252bLIhj7rfgcv2%2febyE%3d>; POPULATE: YES; VERIFIED: NO
J5 J6 = openag-connectors:OPENAG-RS485-RJ12: Assmann WSW Components - A-2004-1-4-LP-N-R - RJ12 CONN MOD JACK 6P6C R/A UNSHLD Description: Jack Modular Connector 6p6c (RJ11, RJ12, RJ14, RJ25) 90° Angle (Right) Unshielded Technical Specifications: Connector Type: Jack Number of Positions/Contacts: 6p6c (RJ11, RJ12, RJ14, RJ25) Number of Ports: 1 Number of Rows: 1 Mounting Type: Through Hole Orientation: 90° Angle (Right) Termination: Solder Shielding: Unshielded Features: Board Lock LED Color: Does Not Contain LED Tab Direction: Down Contact Material: Phosphor Bronze Contact Finish: Gold Contact Finish Thickness: 6µin (0.152µm) Housing Material: Polybutylene Terephthalate (PBT), Glass Filled Operating Temperature: -40°C ~ 85°C Datasheet(s): A-2004-1-4-LP-N Drawing <http://www.assmann-wsw.com/fileadmin/datasheets/ASS_7320_CO.pdf> Vendor(s): Digikey: AE10383-ND <https://www.digikey.com/product-detail/en/assmann-wsw-components/A-2004-1-4-LP-N-R/AE10383-ND/2183634>
J7 = openag-connectors:OPENAG-I2C-HEADER: Fits standard 100 mil header footprint; POPULATE: NO; VERIFIED: NO
J8 = openag-connectors:100-MIL-HEADER-JUMPER; POPULATE: YES; VERIFIED: NO
L1-L6 = openag-inductors:120UH-74404064121: Wurth Electronics - 74404064121 - FIXED IND 120UH 790MA 520 MOHM Technical Specifications: Inductance: 120uH Rated Current: 790mA Saturation Current: 980mA DC Resistance: 520mΩ Operating Temperature: -40° C to 125°C Datasheet(s): 74404064121 Drawing <http://katalog.we-online.de/pbs/datasheet/74404064121.pdf> Vendors: Digikey: 732-7258-1-ND <https://www.digikey.com/product-detail/en/wurth-electronics-inc/74404064121/732-7258-1-ND/5353238>; POPULATE: YES; VERIFIED: NO
R1-R5 R15-R25 R30-R33 = openag-resistors:0OHM-RC0603JR-070RL: Yageo - RC0603JR-070RL - RES SMD 0 OHM JUMPER 1/10W 0603 Description: 0 Ohms Jumper 0.1W, 1/10W Chip Resistor 0603 (1608 Metric) Moisture Resistant Thick Film Technical Specifications: Resistance: 0 Ohms Power: 0.1W, 1/10W Operating Temperature: -55°C ~ 155°C Package / Case: 0603 (1608 Metric) Datasheet(s): RC Series, L Datasheet <http://www.yageo.com/documents/recent/PYu-RC_Group_51_RoHS_L_8.pdf> Vendor(s): Digikey: 311-0.0GRCT-ND <https://www.digikey.com/product-detail/en/yageo/RC0603JR-070RL/311-0.0GRCT-ND/729622>; POPULATE: YES; VERIFIED: NO
R6-R14 R26 R28 = openag-resistors:1K-ERJ-PB3D1001V: Panasonic - P20283CT-ND - RES SMD 1K OHM 0.5% 1/5W 0603 Description: 1 kOhms ±0.5% 0.2W, 1/5W Chip Resistor 0603 (1608 Metric) Automotive AEC-Q200, Pulse Withstanding Thick Film Technical Specifications: Resistance: 1 kOhms Tolerance: ±0.5% Power: 0.2W, 1/5W Operating Temperature: -55°C ~ 155°C Package / Case: 0603 (1608 Metric) Datasheet(s): ERJ-PB3, PB6 Series, High Precision Datasheet <https://industrial.panasonic.com/cdbs/www-data/pdf/RDM0000/AOA0000C328.pdf> Vendor(s): Digikey: P20283CT-ND <https://www.digikey.com/product-detail/en/panasonic-electronic-components/ERJ-PB3D1001V/P20283CT-ND/6214538>; POPULATE: YES; VERIFIED: NO
R27 = openag-resistors:100OHM-RC0603JR-07100RL: Yageo - RC0603JR-07100RL - RES SMD 100 OHM 5% 1/10W 0603 Description: 100 Ohms ±5% 0.1W, 1/10W Chip Resistor 0603 (1608 Metric) Moisture Resistant Thick Film Technical Specifications: Resistance: 100 Ohms Tolerance: ±5% Power (Watts): 0.1W, 1/10W Composition: Thick Film Features: Moisture Resistant Temperature Coefficient: ±100ppm/°C Operating Temperature: -55°C ~ 155°C Package / Case: 0603 (1608 Metric) Supplier Device Package: 0603 Size / Dimension: 0.063" L x 0.032" W (1.60mm x 0.80mm) Height - Seated (Max): 0.022" (0.55mm) Number of Terminations: 2 Datasheet(s): Thick Film Chip Resistor Intro <http://www.yageo.com.tw/exep/pages/download/literatures/PYu-R_INT-thick_7.pdf> Chip Resistor Marking <http://www.yageo.com/exep/pages/download/literatures/PYu-R_Marking_2.pdf> RC Series, L Datasheet <http://www.yageo.com/documents/recent/PYu-RC_Group_51_RoHS_L_8.pdf> Vendor(s): Digikey: 311-100GRCT-ND <https://www.digikey.com/product-detail/en/yageo/RC0603JR-07100RL/311-100GRCT-ND/729644>; POPULATE: YES; VERIFIED: NO
R29 = openag-resistors:3.9K-RC0603JR-073K9L: Yageo - RC0603JR-073K9L - RES SMD 3.9K OHM 5% 1/10W 0603 Description: 3.9 kOhms ±5% 0.1W, 1/10W Chip Resistor 0603 (1608 Metric) Moisture Resistant Thick Film Technical Specifications: Resistance: 3.9 kOhms Tolerance: ±5% Power (Watts): 0.1W, 1/10W Composition: Thick Film Features: Moisture Resistant Temperature Coefficient: ±100ppm/°C Operating Temperature: -55°C ~ 155°C Package / Case: 0603 (1608 Metric) Supplier Device Package: 0603 Size / Dimension: 0.063" L x 0.032" W (1.60mm x 0.80mm) Height - Seated (Max): 0.022" (0.55mm) Number of Terminations: 2 Datasheet(s): Thick Film Chip Resistor Intro <http://www.yageo.com.tw/exep/pages/download/literatures/PYu-R_INT-thick_7.pdf> Chip Resistor Marking <http://www.yageo.com/exep/pages/download/literatures/PYu-R_Marking_2.pdf> RC Series, L Datasheet <http://www.yageo.com/documents/recent/PYu-RC_Group_51_RoHS_L_8.pdf> Vendor(s): Digikey: 311-3.9KGRCT-ND <https://www.digikey.com/product-detail/en/yageo/RC0603JR-073K9L/311-3.9KGRCT-ND/729710>; POPULATE: YES; VERIFIED: NO
R56-R62 = openag-resistors:10K-ERJ-3EKF1002V: Panasonic - ERJ-3EKF1002V - RES SMD 10K OHM 1% 1/10W 0603 Description: 10 kOhms ±1% 0.1W, 1/10W Chip Resistor 0603 (1608 Metric) Automotive AEC-Q200 Thick Film Technical Specifications: Resistance: 10kOhms Tolerance: ±1% Power: 0.1W, 1/10W Operating Temperature: -55°C ~ 155°C Package/Case: 0603 (1608 Metric) Datasheet(s): ERJ-3EKF1002V View All Specifications <https://industrial.panasonic.com/ww/products/resistors/chip-resistors/general-purpose-chip-resistors/precision-thick-film-chip-resistors/ERJ3EKF1002V> Vendor(s): Digikey: P10.0KHCT-ND <https://www.digikey.com/product-detail/en/panasonic-electronic-components/ERJ-3EKF1002V/P10.0KHCT-ND/198102>; POPULATE: YES; VERIFIED: NO
SJ_A0 SJ_A1-SJ_A5 = openag-connectors:SOLDERJUMPER: SMD Solder JUMPER Solder the two pads together to create a connection, or remove the solder to break it. REFLOW - Use this footprint for solder paste and reflow ovens. WAVE - Use this footprint for hand-soldering (larger pads). CLOSED - Has a trace between the two pads to ensure it is closed by default. The trace needs to be cut to disable the jumper, and can be closed again by creating a solder bridge between the two pads.; POPULATE: YES; VERIFIED: NO
SW1 = openag-switches:BF3-1020: Omron - BF3-1020 -SWITCH TACTILE SPST-NO 0.05A 24V Description: Tactile Switch SPST-NO Top Actuated Through Hole Technical Specifications: Circuit: SPST-NO Switch Function: Off-Mom Contact Rating @ Voltage: 0.05A @ 24VDC Mounting Type: Through Hole Switch Travel: 0.25mm Mechanical Life: 1,000,000 Cycles Operating Temperature: -25°C ~ 70°C Datasheet(s): B3F Series Datasheet <http://omronfs.omron.com/en_US/ecb/products/pdf/en-b3f.pdf> Vendor(s): Digikey: SW402-ND <https://www.digikey.com/products/en?keywords=B3F-1020>; POPULATE: YES; VERIFIED: NO
U1-U6 = openag-regulators:RCD-24-0.70/VREF: Recom Power - RCD-24-0.70/VREF - LED SUPPLY CC BUCK 2-35V 700MA Description: 700mA 2 ~ 35 V Constant Current LED Driver Buck Topology 1 Output Technical Specifications: Type: Constant Current Topology: Buck Number of Outputs: 1 Voltage - Input (Min): 4.5V Voltage - Input (Max): 36V Voltage - Output: 2 ~ 35 V Current - Output (Max): 700mA Power (Watts): 25W Dimming: Analog Features: SCP Operating Temperature: -40°C ~ 71°C Efficiency: 96% Mounting Type: Through Hole Package / Case: 6-DIP Module Size / Dimension: 0.87" L x 0.49" W x 0.33" H (22.1mm x 12.6mm x 8.5mm) Approvals: cULus Weight: 0.01 lb (4.54g) Datasheet(s): RCD-24 Series Datasheet <https://www.recom-power.com/pdf/Lightline/RCD-24.pdf> Vendor(s): Digikey: 945-1806-5-ND <https://www.digikey.com/product-detail/en/recom-power/RCD-24-0.70-VREF/945-1806-5-ND/2613767>; POPULATE: YES; VERIFIED: NO
U7 = openag-dacs:DAC5578SPW: Texas Instruments - DAC5578SPW Description: 8 Bit Digital to Analog Converter 8 16-TSSOP Technical Specifications: Number of Bits: 8-bit Number of D/A Converters: 8 Settling Time: 12us Operating Voltage: 2.7V - 5.5V Operating Temperature: -40° C to 125°C Max IDD (Normal Mode): 1.4mA Output Short Circuit Current (Individual): 25mA Datasheet(s): DAC5578,6578,7578 <http://www.ti.com/lit/ds/symlink/dac5578.pdf> Vendor(s): Digikey: 296-27736-5-ND <https://www.digikey.com/product-detail/en/texas-instruments/DAC5578SPW/296-27736-5-ND/2360827>; POPULATE: YES; VERIFIED: NO
U8 = openag-isolators:ISO1540DR: Texas Instruments - ISO1540DR - DGTL ISO 2.5KV 2CH I2C 8SOIC Description: I²C Digital Isolator 2500Vrms 2 Channel 1Mbps 25kV/µs CMTI 8-SOIC (0.154", 3.90mm Width) Technical Specifications: Technology: Capacitive Coupling Type: I²C Number of Channels: 2 Channel Type: Bidirectional Voltage-Isolation: 2500Vrms Voltage - Supply: 3 V ~ 5.5 V Data Rate: 1Mbps Operating Temperature: -40°C ~ 125°C Package / Case: 8-SOIC (0.154", 3.90mm Width) Max Supply Current (3V ≤ VCC1, VCC2 ≤ 3.6V) Side 1, Side 2: 3.8mA, 3.1mA Datasheet(s): ISO154x <http://www.ti.com/lit/ds/symlink/iso1540.pdf> Vendor(s): Digikey: 296-34871-1-ND <https://www.digikey.com/product-detail/en/texas-instruments/ISO1540DR/296-34871-1-ND/3587214>; POPULATE: YES; VERIFIED: NO
U9 = openag-microcontrollers:CY8C4124PVI-432: Cypress - CY8C4124PVI-432 - IC MCU 32BIT 16KB FLASH 28SSOP Description: ARM® Cortex®-M0 PSOC® 4 CY8C41xx Microcontroller IC 32-Bit 24MHz 16KB (16K x 8) FLASH 28-SSOP Technical Specifications: Core Processor: ARM® Cortex®-M0 Core Size: 32-Bit Core Speed: 24 MHz Connectivity: I²C, IrDA, LIN, Microwire, SmartCard, SPI, SSP, UART/USART Peripherals: Brown-out Detect/Reset, LVD, POR, PWM, WDT Number of IO: 24 Program Memory Size: 16KB (16K x 8) Program Memory Type: FLASH RAM Size: 4K x 8 Supply Voltage: 1.71 V ~ 5.5 V Data Converters: A/D 8x12b Oscillator Type: Internal Operating Temperature: -40°C ~ 85°C (TA) Package / Case: 28-SSOP (0.209", 5.30mm Width) Datasheet(s): PSoC 4100 Family <http://www.cypress.com/file/138651/download> Vendor(s): Digikey: 428-3348-ND <https://www.digikey.com/product-detail/en/cypress-semiconductor-corp/CY8C4124PVI-432/428-3348-ND/4895074>; POPULATE: YES; VERIFIED: NO
U10 = openag-isolators:ADM2481BRWZ-RL7: Analog Devices - ADM2481BRWZ-RL7 - DGTL ISO RS422/RS485 16SOIC Description: RS422, RS485 Digital Isolator 2500Vrms 3 Channel 500kbps 25kV/µs CMTI 16-SOIC (0.295", 7.50mm Width) Technical Specifications: Technology: Magnetic Coupling Type: RS422, RS485 Isolated Power: No Number of Channels: 3 Inputs - Side 1/Side 2: 2/1 Channel Type: Bidirectional Voltage - Isolation: 2500Vrms Common Mode Transient Immunity (Min): 25kV/µs Data Rate: 500kbps Rise / Fall Time (Typ): 600ns, 600ns (Max) Supply Voltage: 3.3 V ~ 5 V Operating Temperature: -40°C ~ 85°C Package / Case: 16-SOIC (0.295", 7.50mm Width) Datasheet(s): ADM2481 <http://www.analog.com/media/en/technical-documentation/data-sheets/ADM2481.pdf> Vendor(s): Digikey: ADM2481BRWZ-RL7TR-ND <https://www.digikey.com/product-detail/en/analog-devices-inc/ADM2481BRWZ-RL7/ADM2481BRWZ-RL7TR-ND/2606655>
U11 = openag-microcontrollers:PHOTONH: PARTICLE - PHOTONH - Tiny Wi-Fi dev board w/cloud backend Description: The Photon is a $19 tiny Wi-Fi development kit for creating connected projects and products for the Internet of Things. It's easy to use, it's powerful, and it's connected to the cloud. Technical Specifications: Processor: STM32F205RGY6 120Mhz ARM Cortex M3 Wireless: 802.11b/g/n Wi-Fi Peripherals: Digital(x18), ADC(x8), DAC(x2), SPI(x2), I2S(x1), I2C(x1) SPI, CAN(1), USB(1), PWM(9) Memory: 1MB flash, 128KB RAM Cerfifications: FCC, CE and IC Operating Temperature: -20°C ~ 60°C Humidity Range: Non condensing, relative humidity: 95% Supply Input Voltage (VIN): 3.6V ~ 5.5V Supply Input Voltage (3V3): 3.0V ~ 3.6V Max Supply Output Current (VIN): 1A Max Supply Output Current (3V3): 100mA Average Operating Current (WiFi on, @VIN): up to 100mA Peak Operating Current (WiFi on, @VIN): up to 430mA I/O Max Source/Sink Current (Individual): 25mA I/O Max Source/Sinnk Current (Total): 120mA Datasheet(s): Photon Datasheet <https://docs.particle.io/datasheets/photon-datasheet/> Vendor(s): Particle: PHOTONH <https://store.particle.io/products/photon>; POPULATE: YES; VERIFIED: NO
U12 = openag-regulators:TLV70433DBVR: Texas Instruments - TLV70433DBVR - IC REG LINEAR 3.3V 150MA SOT23-5 Description: Linear Voltage Regulator IC Positive Fixed 1 Output 3.3V 150mA SOT-23-5 Technical Specifications: Output Configuration: Positive Output Type: Fixed Number of Regulators: 1 Voltage - Input (Max): 24V Voltage - Output (Min/Fixed): 3.3V Voltage Dropout (Max): 1.1V @ 100mA Current - Output: 150mA Current - Quiescent (Iq): 4.5µA Current - Supply (Max): 5.5µA PSRR: 60dB (100kHz) Protection Features: Over Current, Reverse Polarity Operating Temperature: -40°C ~ 125°C Mounting Type: Surface Mount Package / Case: SC-74A, SOT-753 Supplier Device Package: SOT-23-5 Datasheet(s): TLV704xx <http://www.ti.com/lit/ds/symlink/tlv704.pdf> Vendor(s): Digikey: 296-39285-1-ND <https://www.digikey.com/product-detail/en/texas-instruments/TLV70433DBVR/296-39285-1-ND/5143276>; POPULATE: YES; VERIFIED: NO
U14 = openag-pwm:PCA9685PW/Q900,118: NXP USA Inc. - PCA9685PW/Q900,118 - IC LED DRVR LIN DIM 25MA 28TSSOP Description: LED Driver IC 16 Output Linear PWM Dimming 25mA 28-TSSOP Technical Specifications: Type: Linear Internal Switch(s): Yes Number of Outputs: 16 Voltage - Supply (Min): 2.3V Voltage - Supply (Max): 5.5V Voltage - Output: 5.5V Current - Output / Channel: 25mA Dimming: PWM Applications: Backlight Operating Temperature: -40°C ~ 85°C (TA) Mounting Type: Surface Mount Package / Case: 28-TSSOP (0.173", 4.40mm Width) Supplier Device Package: 28-TSSOP Base Part Number: PCA9685 Datasheet(s): LED Controllers Leaflet <http://www.nxp.com/documents/leaflet/75016950.pdf> PCA9685 <https://www.nxp.com/docs/en/data-sheet/PCA9685.pdf> Vendor(s): Digikey: 568-5931-1-ND <https://www.digikey.com/product-detail/en/nxp-usa-inc/PCA9685PW-Q900118/568-5931-1-ND/2531218>